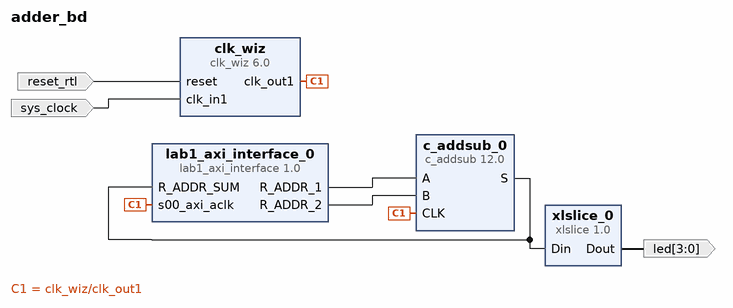
[diagram p0: block diagram of the top level]
# Vivado block design adder_bd, xc7z020clg400-1, Vivado 2023.2
create_bd_design adder_bd

create_bd_port -dir I -type clk sys_clock
set_property -dict {CONFIG.FREQ_HZ 125000000 CONFIG.PHASE 0.0} [get_bd_ports sys_clock]
create_bd_port -dir I -type rst reset_rtl
set_property -dict {CONFIG.POLARITY ACTIVE_HIGH} [get_bd_ports reset_rtl]
create_bd_port -dir O -from 3 -to 0 led

create_bd_cell -type ip -vlnv xilinx.com:ip:c_addsub:12.0 c_addsub_0
set_property -dict [list \
  CONFIG.A_Width 32 \
  CONFIG.B_Value 00000000000000000000000000000000 \
  CONFIG.B_Width 32 \
  CONFIG.Latency 1 \
  CONFIG.Out_Width 32 \
] [get_bd_cells c_addsub_0]
create_bd_cell -type ip -vlnv xilinx.com:ip:clk_wiz:6.0 clk_wiz
set_property -dict {CONFIG.CLK_IN1_BOARD_INTERFACE sys_clock CONFIG.USE_BOARD_FLOW true} [get_bd_cells clk_wiz]
create_bd_cell -type ip -vlnv xilinx.com:ip:xlslice:1.0 xlslice_0
set_property -dict {CONFIG.DIN_FROM 3} [get_bd_cells xlslice_0]
create_bd_cell -type ip -vlnv xilinx.com:user:lab1_axi_interface:1.0 lab1_axi_interface_0

# ---- connections ----

connect_bd_net [get_bd_pins c_addsub_0/S] [get_bd_pins xlslice_0/Din] [get_bd_pins lab1_axi_interface_0/R_ADDR_SUM]
connect_bd_net [get_bd_pins clk_wiz/clk_out1] [get_bd_pins c_addsub_0/CLK] [get_bd_pins lab1_axi_interface_0/s00_axi_aclk]
connect_bd_net [get_bd_pins lab1_axi_interface_0/R_ADDR_1] [get_bd_pins c_addsub_0/A]
connect_bd_net [get_bd_pins lab1_axi_interface_0/R_ADDR_2] [get_bd_pins c_addsub_0/B]
connect_bd_net [get_bd_ports reset_rtl] [get_bd_pins clk_wiz/reset]
connect_bd_net [get_bd_ports sys_clock] [get_bd_pins clk_wiz/clk_in1]
connect_bd_net [get_bd_pins xlslice_0/Dout] [get_bd_ports led]

validate_bd_design
save_bd_design
